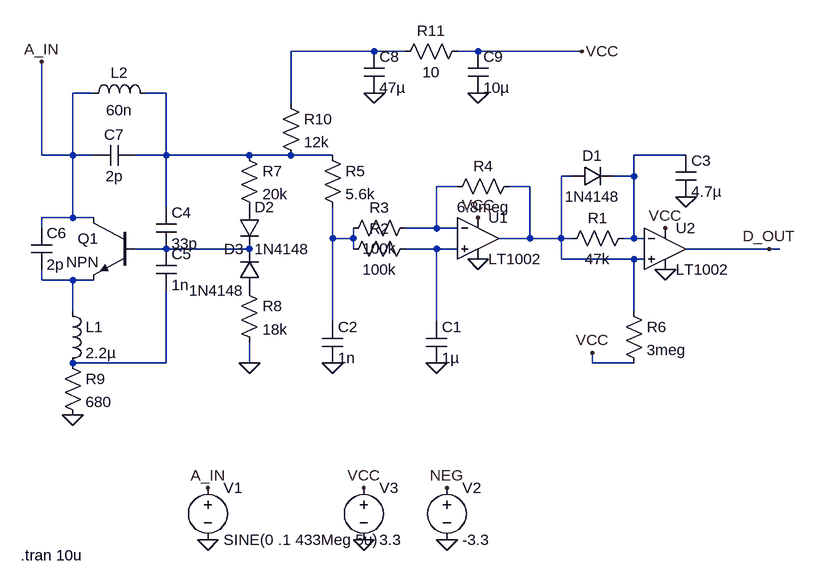
[diagram p0: schematic OOK_demod.asc]
OOK_demod.asc, the LTspice schematic file:
Version 4
SHEET 1 880 680
WIRE 0 -176 -128 -176
WIRE 48 -176 0 -176
WIRE 160 -176 128 -176
WIRE 320 -176 160 -176
WIRE -432 -112 -464 -112
WIRE -320 -112 -352 -112
WIRE -128 -96 -128 -176
WIRE -512 -16 -512 -160
WIRE -464 -16 -464 -112
WIRE -464 -16 -512 -16
WIRE -432 -16 -464 -16
WIRE -320 -16 -320 -112
WIRE -320 -16 -368 -16
WIRE -192 -16 -320 -16
WIRE -128 -16 -192 -16
WIRE -64 -16 -128 -16
WIRE 480 -16 400 -16
WIRE 304 16 288 16
WIRE 400 16 400 -16
WIRE 400 16 368 16
WIRE 128 32 96 32
WIRE 240 32 208 32
WIRE -320 64 -320 -16
WIRE -464 80 -464 -16
WIRE -464 80 -512 80
WIRE -432 80 -464 80
WIRE -512 96 -512 80
WIRE 96 96 96 32
WIRE 96 96 48 96
WIRE 128 96 96 96
WIRE -64 112 -64 64
WIRE -32 112 -32 96
WIRE -32 112 -64 112
WIRE 240 112 240 32
WIRE 240 112 192 112
WIRE 288 112 288 16
WIRE 288 112 240 112
WIRE 304 112 288 112
WIRE 400 112 400 16
WIRE 400 112 384 112
WIRE 416 112 400 112
WIRE -320 128 -368 128
WIRE -192 128 -320 128
WIRE -32 128 -32 112
WIRE 96 128 48 128
WIRE 128 128 96 128
WIRE 608 128 480 128
WIRE 624 128 608 128
WIRE 288 144 288 112
WIRE 400 144 288 144
WIRE 416 144 400 144
WIRE -512 176 -512 160
WIRE -464 176 -512 176
WIRE -432 176 -464 176
WIRE -464 224 -464 176
WIRE 400 224 400 144
WIRE -64 240 -64 112
WIRE 96 240 96 128
WIRE -320 304 -320 192
WIRE -320 304 -464 304
WIRE -192 304 -192 272
WIRE 336 304 336 288
WIRE 400 304 336 304
FLAG 96 304 0
FLAG -64 304 0
FLAG 480 48 0
FLAG 336 288 VCC
FLAG -192 304 0
FLAG -464 384 0
FLAG 448 96 VCC
FLAG 160 80 VCC
FLAG 0 -112 0
FLAG 160 -112 0
FLAG -512 -160 A_IN
FLAG 608 128 D_OUT
FLAG -256 576 0
FLAG -16 576 0
FLAG -16 496 VCC
FLAG -256 496 A_IN
FLAG 320 -176 VCC
FLAG 112 576 0
FLAG 112 496 NEG
FLAG 448 160 0
FLAG 160 144 0
SYMBOL Opamps\\LT1002 160 48 R0
SYMATTR InstName U1
SYMBOL Opamps\\LT1002 448 64 R0
SYMATTR InstName U2
SYMBOL res 400 96 R90
WINDOW 0 0 56 VBottom 2
WINDOW 3 32 56 VTop 2
SYMATTR InstName R1
SYMATTR Value 47k
SYMBOL diode 304 32 R270
WINDOW 0 32 32 VTop 2
WINDOW 3 0 32 VBottom 2
SYMATTR InstName D1
SYMATTR Value 1N4148
SYMBOL cap 80 240 R0
SYMATTR InstName C1
SYMATTR Value 1µ
SYMBOL res 64 112 R90
WINDOW 0 0 56 VBottom 2
WINDOW 3 32 56 VTop 2
SYMATTR InstName R2
SYMATTR Value 100k
SYMBOL res 64 80 R90
WINDOW 0 0 56 VBottom 2
WINDOW 3 32 56 VTop 2
SYMATTR InstName R3
SYMATTR Value 100k
SYMBOL res 224 16 R90
WINDOW 0 0 56 VBottom 2
WINDOW 3 32 56 VTop 2
SYMATTR InstName R4
SYMATTR Value 6.8meg
SYMBOL cap -80 240 R0
SYMATTR InstName C2
SYMATTR Value 1n
SYMBOL res -80 -32 R0
SYMATTR InstName R5
SYMATTR Value 5.6k
SYMBOL cap 464 -16 R0
SYMATTR InstName C3
SYMATTR Value 4.7µ
SYMBOL res 384 208 R0
SYMATTR InstName R6
SYMATTR Value 3meg
SYMBOL res -208 -32 R0
SYMATTR InstName R7
SYMATTR Value 20k
SYMBOL diode -208 64 R0
SYMATTR InstName D2
SYMATTR Value 1N4148
SYMBOL diode -176 192 R180
WINDOW 0 24 64 Left 2
WINDOW 3 24 0 Left 2
SYMATTR InstName D3
SYMATTR Value 1N4148
SYMBOL res -208 176 R0
SYMATTR InstName R8
SYMATTR Value 18k
SYMBOL cap -336 64 R0
SYMATTR InstName C4
SYMATTR Value 33p
SYMBOL cap -336 128 R0
SYMATTR InstName C5
SYMATTR Value 1n
SYMBOL cap -528 96 R0
SYMATTR InstName C6
SYMATTR Value 2p
SYMBOL ind -480 208 R0
SYMATTR InstName L1
SYMATTR Value 2.2µ
SYMBOL res -480 288 R0
SYMATTR InstName R9
SYMATTR Value 680
SYMBOL cap -368 -32 R90
WINDOW 0 0 32 VBottom 2
WINDOW 3 32 32 VTop 2
SYMATTR InstName C7
SYMATTR Value 2p
SYMBOL res -144 -112 R0
SYMATTR InstName R10
SYMATTR Value 12k
SYMBOL cap -16 -176 R0
SYMATTR InstName C8
SYMATTR Value 47µ
SYMBOL cap 144 -176 R0
SYMATTR InstName C9
SYMATTR Value 10µ
SYMBOL ind -448 -96 R270
WINDOW 0 32 56 VTop 2
WINDOW 3 5 56 VBottom 2
SYMATTR InstName L2
SYMATTR Value 60n
SYMBOL voltage -256 480 R0
WINDOW 123 0 0 Left 2
WINDOW 39 0 0 Left 2
SYMATTR InstName V1
SYMATTR Value SINE(0 .1 433Meg 5u)
SYMBOL voltage -16 480 R0
WINDOW 123 0 0 Left 2
WINDOW 39 0 0 Left 2
SYMATTR InstName V3
SYMATTR Value 3.3
SYMBOL res 32 -160 R270
WINDOW 0 32 56 VTop 2
WINDOW 3 0 56 VBottom 2
SYMATTR InstName R11
SYMATTR Value 10
SYMBOL voltage 112 480 R0
WINDOW 123 0 0 Left 2
WINDOW 39 0 0 Left 2
SYMATTR InstName V2
SYMATTR Value -3.3
SYMBOL npn2 -368 80 M0
SYMATTR InstName Q1
TEXT -544 600 Left 2 !.tran 10u

The netlist it stands for:
* OOK_demod.asc
XU1 N008 N005 VCC 0 N004 LT1002  ; pins In+ In- V+ V- OUT
XU2 N004 N003 VCC 0 D_OUT LT1002  ; pins In+ In- V+ V- OUT
R1 N003 N004 47k
D1 N004 N003 1N4148
C1 N008 0 1µ
R2 N008 N006 100k
R3 N005 N006 100k
R4 N004 N005 6.8meg
C2 N006 0 1n
R5 N002 N006 5.6k
C3 N003 0 4.7µ
R6 N004 VCC 3meg
R7 N002 P001 20k
D2 P001 N007 1N4148
D3 P002 N007 1N4148
R8 P002 0 18k
C4 N002 N007 33p
C5 N007 N010 1n
C6 A_IN N009 2p
L1 N009 N010 2.2µ
R9 N010 0 680
C7 N002 A_IN 2p
R10 N001 N002 12k
C8 N001 0 47µ
C9 VCC 0 10µ
L2 A_IN N002 60n
V1 A_IN 0 SINE(0 .1 433Meg 5u)
V3 VCC 0 3.3
R11 N001 VCC 10
V2 NEG 0 -3.3
Q1 A_IN N007 N009 0 NPN
.model D D
.lib standard.dio
.model NPN NPN
.model PNP PNP
.lib standard.bjt
.tran 10u
.backanno
.end